# Altium schematic sheet uSD_CARD.SchDoc
size A4; SheetNumber: 9; SheetTotal: 16
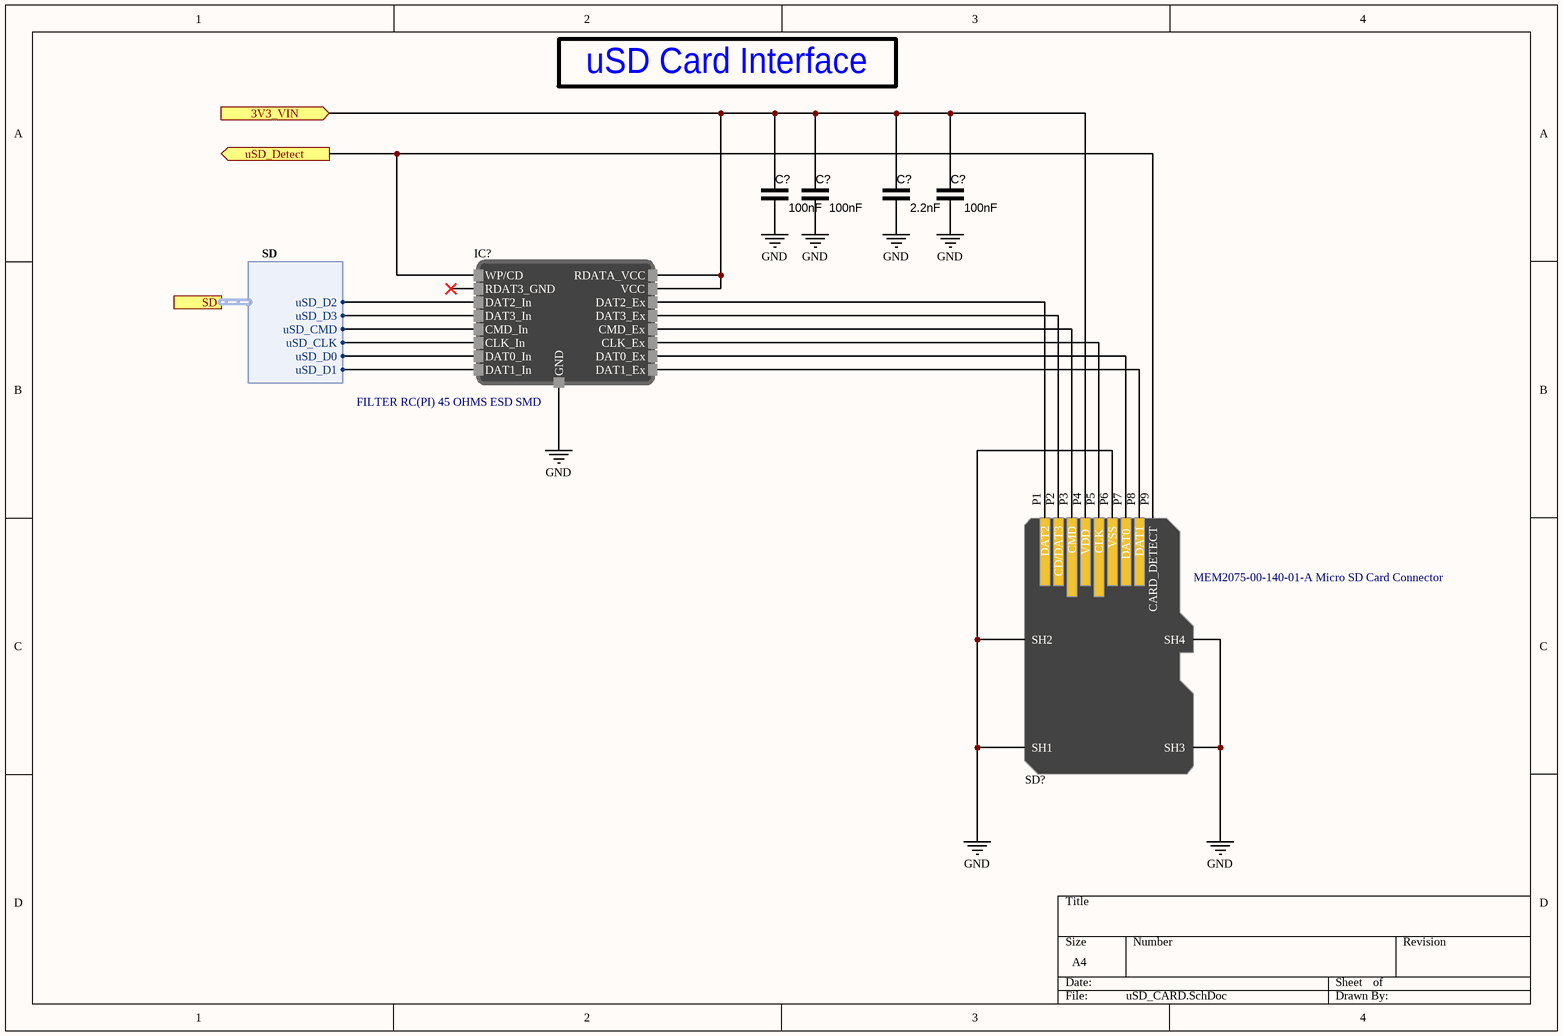
[diagram p0: uSD_CARD.SchDoc]

## Parts
(Parts that share a designator on the sheet are numbered #1, #2 ... from top to bottom, then left to right.)
C?#1  100nF  [CAP_0603]
C?#2  100nF  [CAP_0603]
C?#3  2.2nF  [CAP_0603]
C?#4  100nF  [CAP_0603]
IC?  FILTER RC(PI) 45 OHMS ESD SMD  [Micro QFN 3.5x1.2-16L]
SD?  MEM2075-00-140-01-A Micro SD Card Connector  [uSD_CARD_9(8+1)]

## Ports
3V3_VIN (in), SD (harness SD), uSD_Detect (out)

## Harnesses
SD: uSD_D2, uSD_D3, uSD_CMD, uSD_CLK, uSD_D0, uSD_D1

## Nets
GND: C?#1.1 C?#2.1 C?#3.1 C?#4.1 IC?.17(GND) SD?.P6(VSS) SD?.SH1 SD?.SH2 SD?.SH3 SD?.SH4
3V3_VIN: C?#1.2 C?#2.2 C?#3.2 C?#4.2 IC?.15(VCC) IC?.16(RDATA_VCC) SD?.P4(VDD) ; port 3V3_VIN
uSD_Detect: IC?.1(WP/CD) SD?.P9(CARD_DETECT) ; port uSD_Detect
NetIC?_3: IC?.3(DAT2_In) ; port SD.uSD_D2
NetIC?_4: IC?.4(DAT3_In) ; port SD.uSD_D3
NetIC?_5: IC?.5(CMD_In) ; port SD.uSD_CMD
NetIC?_6: IC?.6(CLK_In) ; port SD.uSD_CLK
NetIC?_7: IC?.7(DAT0_In) ; port SD.uSD_D0
NetIC?_8: IC?.8(DAT1_In) ; port SD.uSD_D1
NetIC?_9: IC?.9(DAT1_Ex) SD?.P8(DAT1)
NetIC?_10: IC?.10(DAT0_Ex) SD?.P7(DAT0)
NetIC?_11: IC?.11(CLK_Ex) SD?.P5(CLK)
NetIC?_12: IC?.12(CMD_Ex) SD?.P3(CMD)
NetIC?_13: IC?.13(DAT3_Ex) SD?.P2(CD/DAT3)
NetIC?_14: IC?.14(DAT2_Ex) SD?.P1(DAT2)

Not connected (* = marked no-connect by the designer): IC? 2(RDAT3_GND)*

## Notes on the sheet
- uSD Card Interface

## Library data of the parts
C?#1 C?#2 C?#4 = C000007: 0.1 µF ±10% 25V Ceramic Capacitor X7R 0603 (1608 Metric); ComponentLink1Description: DigiKey; ComponentLink1URL: https://www.digikey.com/en/products/detail/kyocera-avx/06033C104K4T2A/8019250; DigiKey Part Number: 478-KAM15AR71E104KTCT-ND; capacitance: 100nF
C?#3 = C000006: 2200 pF ±10% 25V Ceramic Capacitor X7R 0603 (1608 Metric); ComponentLink1Description: DigiKey; ComponentLink1URL: https://www.digikey.com/en/products/detail/yageo/CC0603KRX7R8BB222/2345066; DigiKey Part Number: 311-3653-1-ND; capacitance: 2.2nF
IC? = EMIF06-MSD02N16: RC (Pi) EMI Filter 2nd Order Low Pass 6 Channel R = 45Ohms, C = 20pF (Total) 16-UFDFN Exposed Pad; Digikey Part Number: 497-8751-1-ND; Digikey Link: https://www.digikey.com/en/products/detail/stmicroelectronics/EMIF06-MSD02N16/2043592?s=N4IgTCBcDaIKIFkCSAxADANgLQIMoBE0wA5ARgxAF0BfIA
SD? = 00000015: 9 (8 + 1) Position Card Connector Secure Digital - microSD™ Surface Mount, Right Angle Gold; DigiKey Part Number: 2073-MEM2075-00-140-01-ACT-ND; Mouser Part Number: 640-MEM20750014001A; ComponentLink1Description: DigiKey; ComponentLink1URL: https://www.digikey.com/en/products/detail/gct/MEM2075-00-140-01-A/9859614?s=N4IgTCBcDaILIFE5gAwHYCsBaFKsEYAWPFfLAQRAF0BfIA; ComponentLink2Description: Mouser; ComponentLink2URL: https://eu.mouser.com/ProductDetail/GCT/MEM2075-00-140-01-A?qs=KUoIvG%2F9IlZvfWpeERlq3Q%3D%3D